# EasyEDA Pro project sensor_board수정본.eprj

# Schematic Schematic1
Board Name: Board1; Create Date: 2025-08-01; Page Name: P1; Project Name: sensor_board수정본; Schematic Name: Schematic1; Update Date: 2025-08-01; Company: EasyEDA.com; Page Size: A4; Version: V1.0
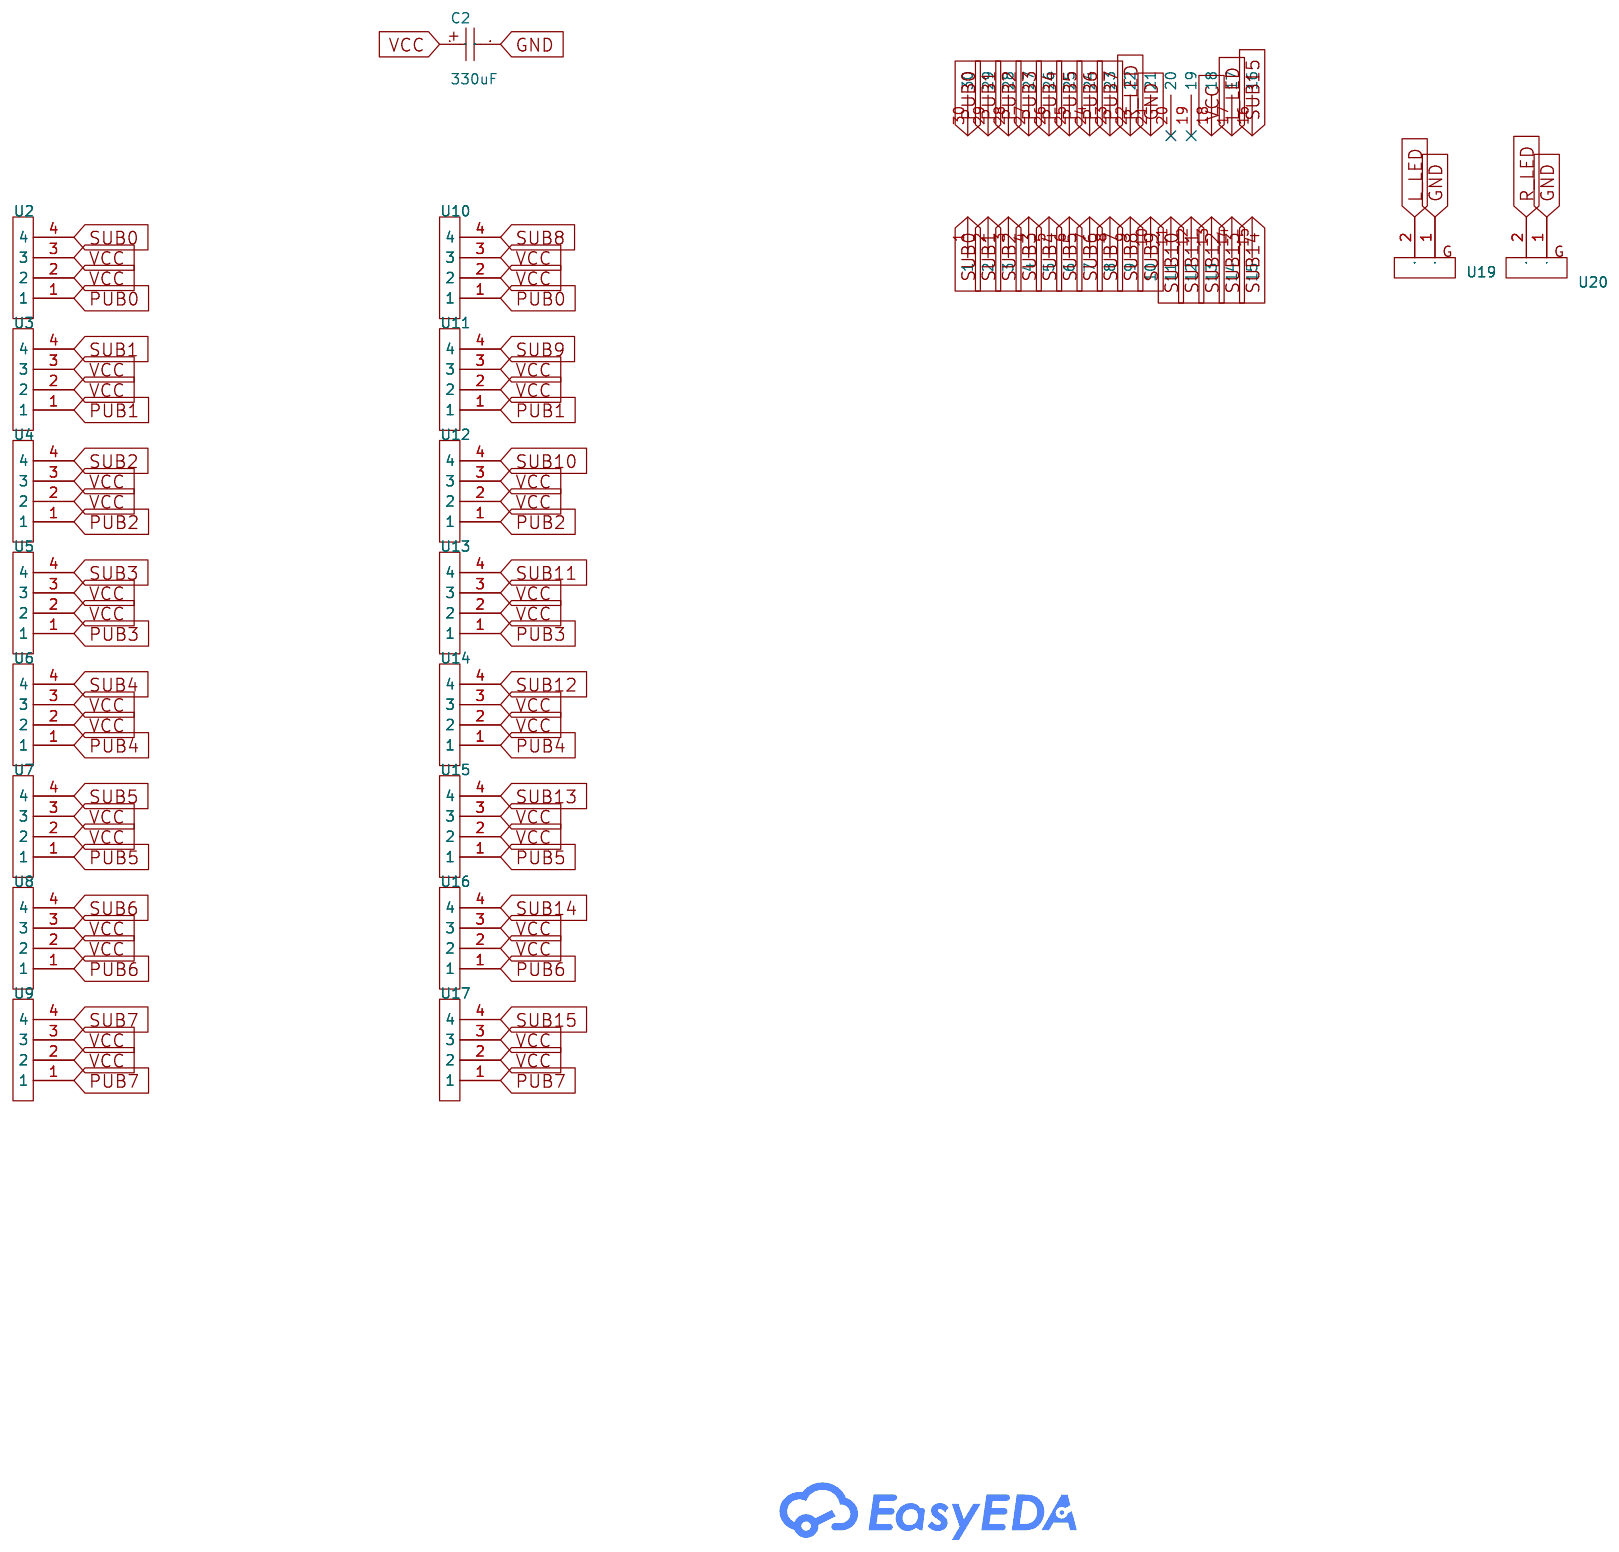
[diagram p0: schematic sheet]

## Parts
C2  330uF  [CASE-D_7343]
U1  -  [header_pin(2*15)]
U2  -  [4pin]
U3  -  [4pin]
U4  -  [4pin]
U5  -  [4pin]
U6  -  [4pin]
U7  -  [4pin]
U8  -  [4pin]
U9  -  [4pin]
U10  -  [4pin]
U11  -  [4pin]
U12  -  [4pin]
U13  -  [4pin]
U14  -  [4pin]
U15  -  [4pin]
U16  -  [4pin]
U17  -  [4pin]
U19  -  [pub_pin]
U20  -  [pub_pin]

## Library data of the parts
C2 = TAJD337M006RNJ: Capacitance: Tolerance:±20% Tolerance:±20% Rated Voltage: Equivalent Series Resistance(ESR):400mΩ@100kHz Operating Temperature:-55℃~+125℃ Operating Temperature:-55℃~+125℃; LCSC Part Name: 330uF ±20% 6.3V; Supplier Part: C22283; Manufacturer: Kyocera AVX; Supplier Footprint: CASE-D-7343; JLCPCB Part Class: Extended Part; Datasheet: https://atta.szlcsc.com/upload/public/pdf/source/20160107/1457707750344.pdf; Supplier: LCSC; Tolerance: ±20%; Equivalent Series Resistance(ESR): 400mΩ@100kHz; Operating Temperature: -55℃~+125℃
U1 = header_pin(2_15)
U2-U17 = 4pin
U19 U20 = pub_pin

## Nets
GND: C2.2 U1.21 U19.1 U20.1
VCC: C2.1 U1.18 U2.2 U2.3 U3.2 U3.3 U4.2 U4.3 U5.2 U5.3 U6.2 U6.3 U7.2 U7.3 U8.2 U8.3 U9.2 U9.3 U10.2 U10.3 U11.2 U11.3 U12.2 U12.3 U13.2 U13.3 U14.2 U14.3 U15.2 U15.3 U16.2 U16.3 U17.2 U17.3
L_LED: U1.17 U19.2
PUB0: U1.30 U2.1 U10.1
PUB1: U1.29 U3.1 U11.1
PUB2: U1.28 U4.1 U12.1
PUB3: U1.27 U5.1 U13.1
PUB4: U1.26 U6.1 U14.1
PUB5: U1.25 U7.1 U15.1
PUB6: U1.24 U8.1 U16.1
PUB7: U1.23 U9.1 U17.1
R_LED: U1.22 U20.2
SUB0: U1.1 U2.4
SUB1: U1.2 U3.4
SUB2: U1.3 U4.4
SUB3: U1.4 U5.4
SUB4: U1.5 U6.4
SUB5: U1.6 U7.4
SUB6: U1.7 U8.4
SUB7: U1.8 U9.4
SUB8: U1.9 U10.4
SUB9: U1.10 U11.4
SUB10: U1.11 U12.4
SUB11: U1.12 U13.4
SUB12: U1.13 U14.4
SUB13: U1.14 U15.4
SUB14: U1.15 U16.4
SUB15: U1.16 U17.4

Not connected (* = marked no-connect by the designer): U1 19* 20*

# Board PCB1
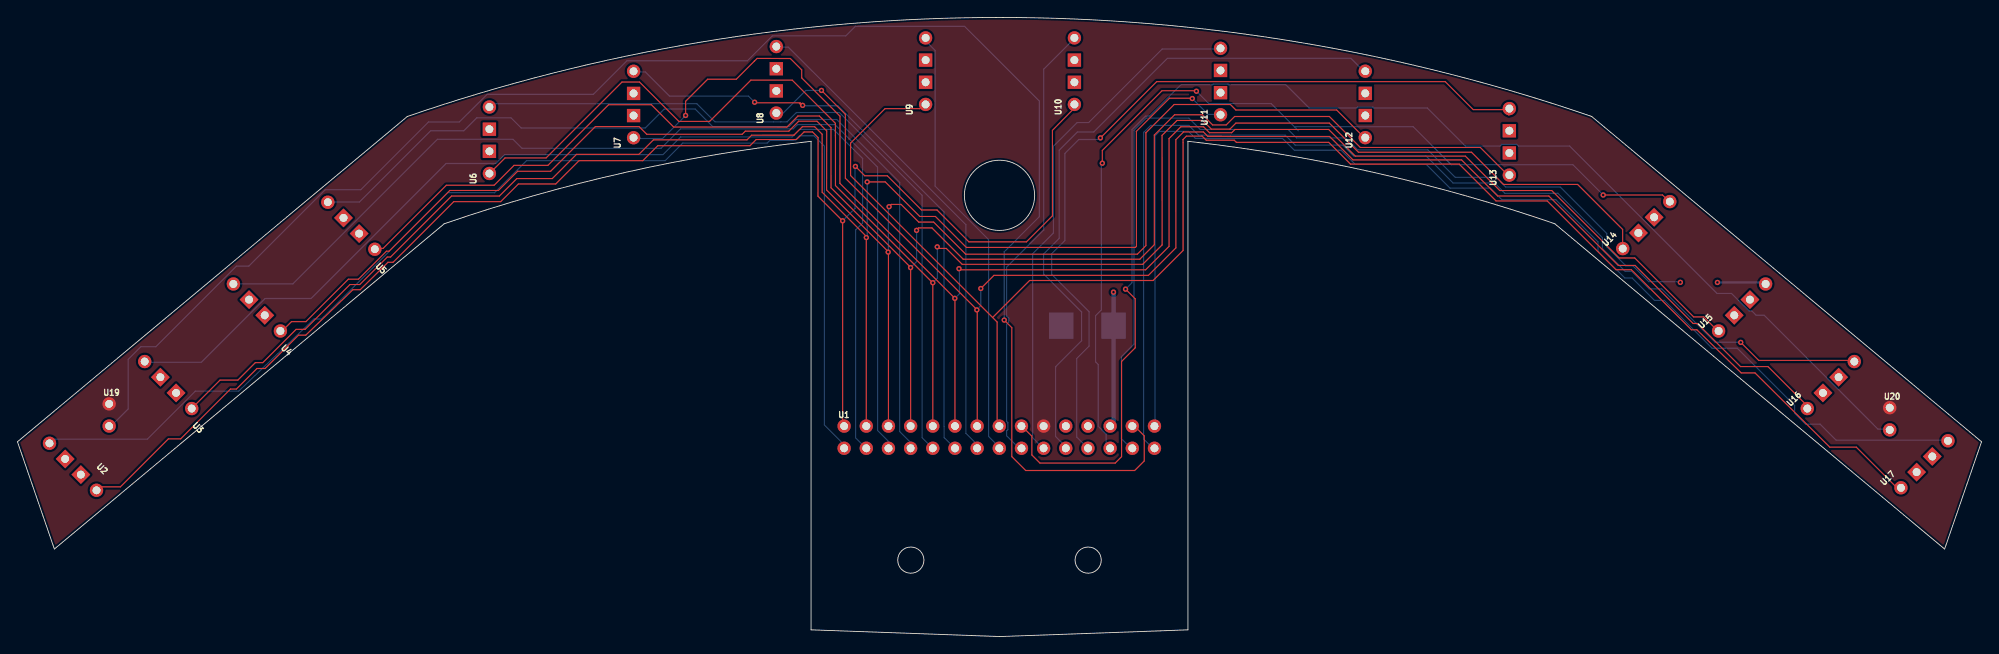
[diagram p1: board, top side]
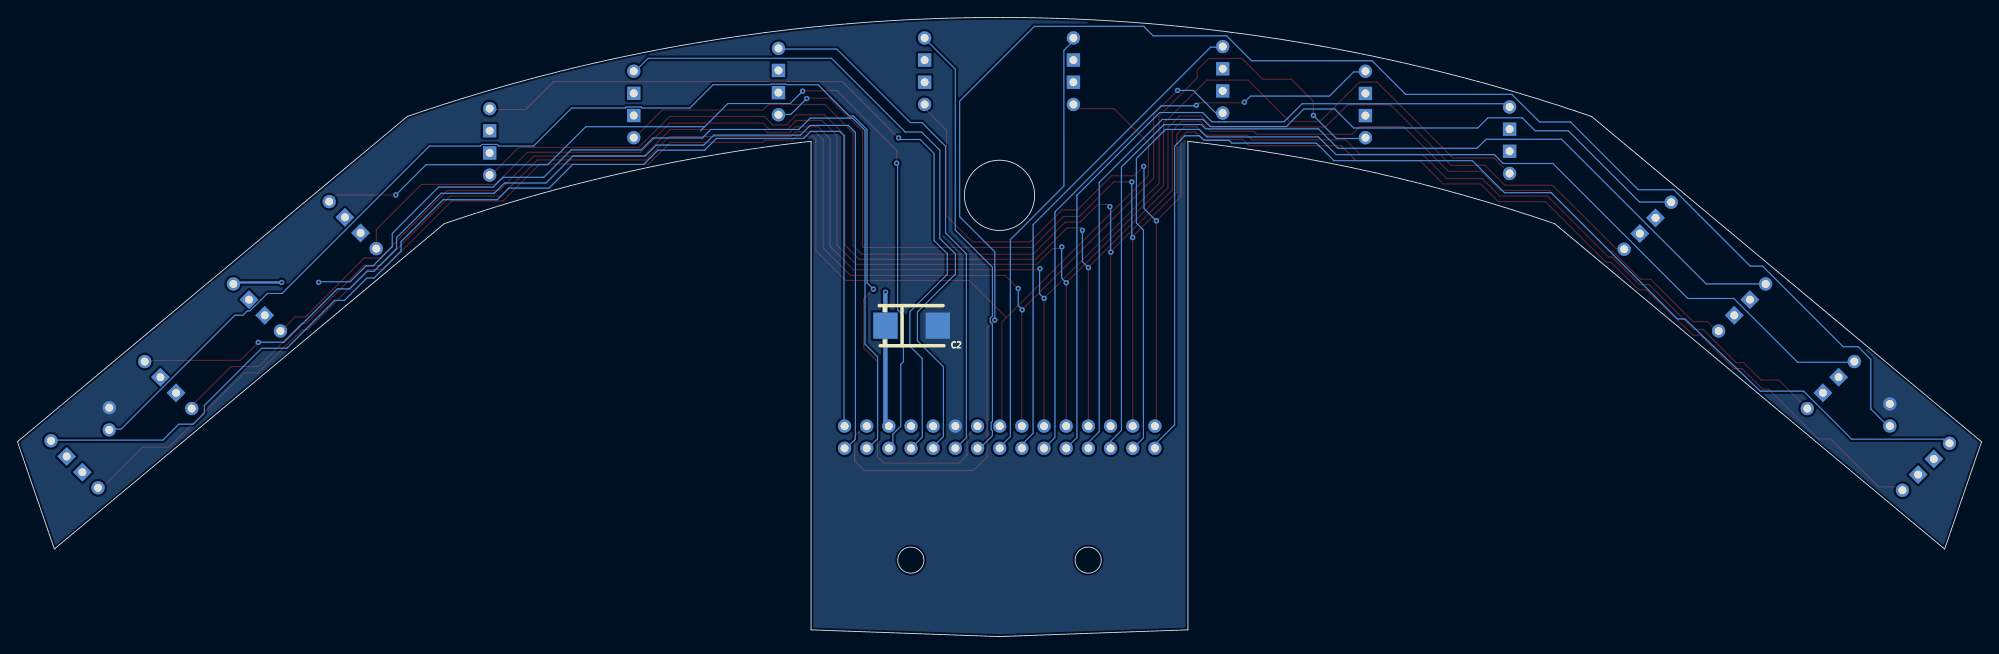
[diagram p2: board, bottom side, seen from below]

Outline 225.05 x 70.96 mm; copper layers: Top Layer, Inner1, Inner2, Bottom Layer. Coordinates in mm from the lower left corner of the outline.
Outline path: circle c102.37,8.76 r1.5 ; circle c112.53,50.57 r4.03 ; circle c122.69,8.76 r1.5 ; 0,22.33 4.23,10.03 48.9,47.31 arc(69.66,53.2) 90.94,56.76 90.94,0.77 112.53,0 134.12,0.77 134.12,56.76 arc(155.39,53.2) 176.15,47.31 220.82,10.03 225.05,22.33 180.38,59.61 arc(112.53,70.96) 44.67,59.61 0,22.33
Stack: Top Layer 0.035mm Outer layer thickness 1oz / Dielectric1 0.2104mm 7628 RC49% 8.6mil / Inner1 0.0152mm Inner layer thickness / Dielectric2 1.065mm 1.1mm H/HOZ Copper / Inner2 0.0152mm Inner layer thickness / Dielectric3 0.2104mm 7628 RC49% 8.6mil / Bottom Layer 0.035mm Outer layer thickness 1oz

## Design rules (mm)
template: Custom Config
spacing copperThickness1oz (default): track to track 0.102, other pairs 0.152 to 0.3
spacing copperThickness2oz: track to track 0.203, other pairs 0.152 to 0.3
track width copperThickness1oz (default): min 0.127, default 0.254, max 2.54
track width copperThickness2oz: min 0.203, default 0.254, max 2.54
differential pair differentialPair (default): width min 0.127, default 0.254, max 2.54; gap min 0.152, default 0.152
via viaSize (default): diameter min 0.5, default 0.61, max 10; hole min 0.3, default 0.305, max 6.3

## Placement (name value [footprint] x y rotation side)
C2  330uF  [CASE-D_7343]  122.6 35.63 0 bottom
U1  -  [header_pin(2*15)]  133.46 24.12 0 top
U2  -  [4pin]  6.37 19.46 135 top
U3  -  [4pin]  17.28 28.83 135 top
U4  -  [4pin]  27.44 37.72 135 top
U5  -  [4pin]  38.26 47.08 135 top
U6  -  [4pin]  54.08 56.88 90 top
U7  -  [4pin]  70.6 60.98 90 top
U8  -  [4pin]  86.95 63.81 90 top
U9  -  [4pin]  104.06 64.8 90 top
U10  -  [4pin]  121.11 64.8 90 top
U11  -  [4pin]  137.85 63.61 90 top
U12  -  [4pin]  154.44 60.99 90 top
U13  -  [4pin]  170.95 56.7 90 top
U14  -  [4pin]  186.64 47.16 45 top
U15  -  [4pin]  197.62 37.72 45 top
U16  -  [4pin]  207.78 28.83 45 top
U17  -  [4pin]  218.51 19.74 45 top
U19  -  [pub_pin]  25.37 11.05 0 top
U20  -  [pub_pin]  229.39 10.61 0 top

## Footprints (pads in the part's own frame, mm; a bottom-side part is the same pattern mirrored in y, then rotated)
4pin
  round 1.524 hole 0.914: 1(-3.81,0) 4(3.81,0)
  rect 1.524x1.524 hole 0.914: 2(-1.27,0) 3(1.27,0)
CASE-D_7343
  rect 2.799x3.01 smd: 1(3,0) 2(-3,0)
header_pin(2*15)
  round 1.524 hole 0.914: 1(-38.735,-2.54) 2(-36.195,-2.54) 3(-33.655,-2.54) 4(-31.115,-2.54) 5(-28.575,-2.54) 6(-26.035,-2.54) 7(-23.495,-2.54) 8(-20.955,-2.54) 9(-18.415,-2.54) 10(-15.875,-2.54) 11(-13.335,-2.54) 12(-10.795,-2.54) 13(-8.255,-2.54) 14(-5.715,-2.54) 15(-3.175,-2.54) 16(-3.175,0) 17(-5.715,0) 18(-8.255,0) 19(-10.795,0) 20(-13.335,0) 21(-15.875,0) 22(-18.415,0) 23(-20.955,0) 24(-23.495,0) 25(-26.035,0) 26(-28.575,0) 27(-31.115,0) 28(-33.655,0) 29(-36.195,0) 30(-38.735,0)
pub_pin
  round 1.524 hole 0.914: 1(-14.859,15.621) 2(-14.859,13.081)

## Nets
As in the schematic.

Pads without a net: U1 19 20

## Via types
v1: diameter 0.61, hole 0.305, Top Layer to Bottom Layer, 29 vias

## Routing (per net, layer and track width the routed paths; a pad name or vN(x,y) marks a point on that pad's centre or on a via; arc(x,y) is an arc through that point)
VCC: length 323
  Inner2 w0.254: 103.58,65.98 103.96,65.98 104.1,65.83 ; 121.06,63.34 121.06,63.36
  Inner2 w0.5: 216.9,18.82 217.62,18.82 218.77,19.97 218.77,20.74 ; 104.1,65.83 104.1,63.93 103.72,63.55 ; 104.06,63.36 121.06,63.36 ; 206.99,27.99 208.74,29.75 199.93,38.56 198.56,38.56 ; 5.24,20.41 5.25,20.41 7.07,18.6 7.81,18.6 17.1,27.89 18.12,27.89 ; 16.39,29.78 16.47,29.78 18.25,28 19.52,28 28.3,36.79 ; 185.73,46.25 187.38,47.9 187.43,47.9 ; 170.85,55.37 170.93,55.45 170.93,57.98 ; 121.08,63.36 122.35,63.36 125.57,60.15 125.57,60.28 129.02,63.73 135.71,63.73 137.11,62.34 137.87,62.34 ; 137.89,64.95 137.87,64.93 137.87,62.34 ; 185.87,46.33 189.05,43.15 193.89,43.15 198.42,38.62 196.63,36.83 196.63,36.5 ; 216.87,18.82 207.87,27.82 206.79,27.82 ; 185.73,46.22 183.34,46.22 174.2,55.37 170.87,55.37 ; 26.52,38.54 26.74,38.54 28.33,36.95 29.9,36.95 39.1,46.26 ; 103.72,63.36 102,63.36 101.55,63.81 88.49,63.81 87.38,64.92 87.08,64.92 ; 39.1,46.26 48.46,55.63 54.12,55.63 ; 39.1,46.26 37.48,47.88 37.37,47.88 ; 88.45,63.81 87.13,62.49 ; 121.14,65.88 121.06,65.81 121.06,63.88 ; 121.55,63.43 121.35,63.63 121.1,63.88 ; 137.87,62.34 137.9,62.34 ; 70.54,59.8 55.82,59.8 54.2,58.18 54.2,55.76 ; 125.56,60.11 125.57,60.12 ; 170.87,57.98 169.14,59.71 154.42,59.71 154.51,59.79 154.51,62.18 154.29,62.39 137.99,62.39 ; 125.59,39.44 125.59,60.1 ; 70.54,62.27 70.54,59.91 ; 86.91,62.57 70.82,62.57
  Bottom Layer w0.254: 137.72,64.45 137.76,64.49 ; 125.61,39.45 v1(125.59,39.47)
  Bottom Layer w0.5: 196.85,36.89 196.85,36.89 ; U1.18 125.6,24.52 125.6,35.63 125.61,39.45
L_LED: length 196.2
  Top Layer w0.127: 127.84,24.27 129.11,23 129.11,20.13 128.01,19.03 115.53,19.03 113.94,20.62 113.94,35.4 v1(113.07,36.27)
  Bottom Layer w0.127: v1(113.07,36.27) 113.07,44.1 117.09,48.12 117.09,61.37 108.52,69.94 96,69.94 94.92,68.85 86.5,68.85 83.64,65.99 69.83,65.99 65.98,62.14 53.82,62.14 50.63,58.98 47.1,58.98 39.34,51.21 35.26,51.21 26.51,42.46 25.09,42.46 15.85,33.22 14.14,33.22 12.69,31.77 12.69,26.09 10.8,24.2 10.62,24.2 10.51,24.31
PUB0: length 182.5
  Top Layer w0.127: 121.71,60.83 121.36,60.83 118.59,58.02 118.59,48.22 115.61,45.24 109.02,45.24 105.37,48.89 103.59,48.89 99.67,52.81 97.09,52.81 v1(96.02,53.88) ; 9.18,16.68 9.66,17.16 11.79,17.16 17.29,22.66 18.7,22.66 24.41,28.36 25.08,28.36 27.44,30.72 28.38,30.72 32.2,34.54 33.03,34.54 38.44,39.75 39.28,39.75 42.46,42.89 43.04,42.89 49.99,49.84 55.37,49.84 57.4,51.87 61.68,51.87 64.35,54.55 71.66,54.54 73.37,56.26 83.94,56.26 84.64,56.96 89.25,56.96 90.13,57.83 91.1,57.83 91.74,57.19 91.73,50.47 v1(94.55,47.65) 94.55,24.29 U1.30
  Bottom Layer w0.127: v1(96.02,53.88) 95.97,53.84 95.97,49.07 v1(94.55,47.65)
PUB1: length 187.4
  Top Layer w0.127: 25.26,29.39 27.26,31.39 28.11,31.39 31.92,35.2 32.96,35.2 38.1,40.34 39.23,40.34 42.38,43.5 42.76,43.5 49.74,50.49 55.21,50.49 57.22,52.49 61.29,52.49 64.06,55.26 71.18,55.26 ; U1.29 97.26,45.87 92.21,50.92 92.2,57.57 91.34,58.43 89.94,58.43 88.97,57.46 84.13,57.46 83.6,56.93 72.87,56.93 71.19,55.25 ; 128.19,57.89 132.01,61.7 134.58,61.7 v1(134.62,61.66) ; v1(97.37,52.11) 99.43,52.11 103.39,48.15 105.18,48.15 108.73,44.6 128.09,44.6 128.22,44.72 128.22,57.89 ; 25.26,29.39 23.21,29.39 19.99,26.17 ; 19.98,26.13 U3.1
  Bottom Layer w0.127: v1(97.37,52.11) 97.37,45.84 97.26,45.73 ; 137.97,59.3 137.43,59.84 136.44,59.84 v1(134.62,61.66)
  vias: v1(97.27,45.73)
PUB2: length 189.5
  Top Layer w0.127: 129.3,57.74 129.3,57.74 ; 129.3,57.74 129.3,44.8 128.32,43.82 108.66,43.82 104.98,47.5 103.27,47.5 101.25,49.53 100.13,49.53 99.96,49.36 99.96,49.28 ; 129.3,57.74 132.54,60.98 138.98,60.98 139.61,60.35 151.16,60.35 154.53,56.98 154.53,56.84 ; U1.28 99.8,44.09 92.71,51.18 92.73,57.95 91.61,59.07 89.52,59.07 88.38,57.92 83.4,57.92 83.04,57.57 72.11,57.57 71.23,58.45 66.22,58.45 61.1,53.33 57.3,53.33 55.1,51.12 49.54,51.12 42.58,44.17 42.28,44.17 39.07,40.96 37.91,40.96 33.05,36.09 31.4,36.09 30.26,34.95 ; 154.47,56.78 154.45,56.77 ; 30.12,34.98 30.23,35.09
  Bottom Layer w0.127: 99.87,49.3 99.79,49.23 99.79,44.01
  vias: v1(99.77,44.06) v1(99.87,49.27)
PUB3: length 191.6
  Top Layer w0.127: 170.93,52.19 170.93,52.74 167.61,56.05 153.87,56.05 150.32,59.6 139.47,59.6 138.5,58.64 136.95,58.64 135.78,59.8 132.59,59.8 130.27,57.48 130.27,44.91 128.6,43.24 108.37,43.24 104.78,46.84 103.24,46.84 103.02,46.62 ; 41.14,44.48 41.9,44.48 49.14,51.72 54.62,51.72 56.89,54 60.78,54 67.73,60.95 72.63,60.95 75.19,58.39 88.17,58.39 89.43,59.66 91.89,59.66 93.22,58.33 93.22,51.43 102.34,42.31 U1.27
  Bottom Layer w0.127: v1(103.02,46.55) 103.02,42.97 v1(102.34,42.29)
PUB4: length 195.3
  Top Layer w0.127: 53.86,52.91 53.93,52.91 55.87,54.85 60.57,54.85 69.27,63.55 71.28,63.55 75.79,59.04 79.31,59.04 84.04,63.77 88.77,63.77 93.72,58.82 93.72,57.39 93.73,57.21 93.73,51.69 104.88,40.53 U1.26 ; 105.38,44.64 105.42,44.64 105.58,44.48 106.43,44.48 108.25,42.66 128.94,42.66 131.16,44.89 131.15,57.44 132.86,59.15 135.8,59.15 136.8,58.15 138.92,58.15 139.61,58.85 150.32,58.85 153.66,55.51 166.61,55.51 170.28,51.82 178.77,51.82 183.93,46.66 183.93,44.5
  Bottom Layer w0.127: v1(104.88,40.55) 105.4,41.07 105.4,44.65 v1(105.39,44.66)
PUB5: length 187.6
  Top Layer w0.127: U1.25 107.42,38.76 94.24,51.94 94.25,59.64 89.86,64.03 89.86,64.95 88.56,66.25 84.75,66.26 84.45,65.96 ; 84.45,65.96 84.45,65.96 ; 84.45,65.96 84.44,65.96 82.36,63.87 79.09,63.87 76.56,61.35 v1(76.56,59.72) ; v1(107.88,42.16) 108.01,42.03 129.27,42.03 131.95,44.72 131.95,57.07 133.31,58.42 135.91,58.42 136.59,57.74 139.12,57.74 139.5,58.12 150.24,58.12 153.3,55.06 165.91,55.06 169.85,51.12 175.8,51.12 183.53,43.39 185.31,43.39 192.07,36.64 193.22,36.64 194.87,34.98 194.97,34.98
  Bottom Layer w0.127: v1(107.41,38.76) 107.93,39.28 107.93,42.11 v1(107.88,42.16) ; 70.62,56.77 70.93,57.08 73.92,57.08 76.56,59.72 v1(76.56,59.72)
PUB6: length 180.3
  Top Layer w0.127: 205.04,26.08 205.04,26.48 200.58,30.94 197.44,30.94 192.5,35.88 192.01,35.88 185.35,42.53 183.43,42.53 175.47,50.49 169.61,50.49 165.47,54.63 153.03,54.63 150.35,57.31 139.03,57.31 ; 136.42,57.32 139.02,57.32 139.03,57.31 ; 136.42,57.32 136.4,57.32 135.88,57.83 133.62,57.83 132.73,56.95 132.73,44.54 129.59,41.39 111.89,41.39 v1(110.38,39.89) ; 136.42,57.32 139.03,57.31 ; 109.98,23.97 109.98,37.42 94.86,52.53 94.86,59.85 v1(92.13,62.59)
  Bottom Layer w0.127: v1(92.13,62.59) 90.33,62.59 87.13,59.4 87.09,59.4
  Bottom Layer w0.128: 109.96,37.5 110.38,37.92 v1(110.38,39.89)
  vias: v1(109.93,37.44)
PUB7: length 185.8
  Top Layer w0.127: 103.4,60.49 103.39,60.5 99.41,60.5 95.46,56.56 95.46,52.83 ; 215.8,16.93 215.47,16.93 210.7,21.71 207.66,21.71 199.09,30.22 197.51,30.22 192.43,35.16 191.81,35.16 184.92,42.04 183.17,42.04 175.28,49.93 169.42,49.93 165.2,54.15 152.74,54.15 150.25,56.64 139.67,56.64 139.43,56.88 136.22,56.88 135.75,57.35 133.94,57.35 133.55,56.96 133.56,56.6 133.56,44.25 130.12,40.81 115.97,40.81 111.74,36.57 ; 112.42,24.18 112.26,24.34 112.26,36.05 111.74,36.57 ; 111.74,36.57 95.47,52.83
R_LED: length 159.4
  Top Layer w0.127: v1(126.97,39.82) 128.08,38.71 128.08,33.1 126.51,31.53 126.51,20.62 125.78,19.88 117.16,19.88 116.24,20.81 116.24,22.97 115.06,24.14
  Bottom Layer w0.127: v1(126.97,39.82) 127.71,40.55 127.71,58.1 129.25,59.65 129.72,59.65 133.31,63.24 136.93,63.24 137,63.32 138.7,63.32 138.78,63.24 145.34,63.24 148.01,60.58 153.47,60.58 153.58,60.69 155.29,60.69 155.41,60.58 161.55,60.58 165.91,56.21 169.9,56.21 170.09,56.41 171.8,56.41 171.99,56.21 177.85,56.21 194.74,39.32 196.41,39.32 197.88,37.85 197.89,37.85 198.43,37.32 198.73,37.32 199.22,36.83 200.14,36.83 213.18,23.77 214.03,23.77 214.46,24.2
SUB0: length 139.3
  Bottom Layer w0.127: 14.91,22.62 4.33,22.62 3.7,21.99 ; 14.91,22.65 20.38,28.12 25.34,28.12 33.98,36.4 34.84,36.4 49.32,50.88 54.66,50.87 58.34,54.54 74.21,54.54 76.23,56.56 85.9,56.56 86.22,56.87 88.75,56.87 arc(88.94,56.89) 89.13,56.92 89.62,57.41 ; U1.1 94.72,21.99 92.46,24.25 92.46,56.2 ; 89.63,57.4 91.28,57.4 92.43,56.23
SUB1: length 128.8
  Bottom Layer w0.127: 21.1,31.44 14.54,31.44 ; 97.23,21.57 96.04,22.76 96.04,46.59 96.84,47.4 96.84,54.79 93.68,57.95 93.53,58.11 93.53,58.12 89.62,58.12 88.76,57.26 75.99,57.26 ; 75.99,57.26 75.97,57.26 ; 75.99,57.26 73.97,55.23 55.82,55.23 54.8,54.22 49.11,54.22 33.64,38.74 28.38,38.74 21.1,31.46 ; 75.99,57.26 76,57.27
SUB2: length 117
  Bottom Layer w0.127: U1.3 99.8,22.37 98.56,23.62 98.56,53.8 93.68,58.67 89.39,58.68 88.9,58.19 75.98,58.19 73.75,55.96 57.82,55.96 56.78,56.99 48.12,56.99 31.55,40.42 24.74,40.42
SUB3: length 105.9
  Bottom Layer w0.127: 52.64,59.45 51.15,57.97 47.41,57.97 ; 52.64,59.45 52.65,59.47 ; 52.64,59.45 56.55,59.45 57.71,58.29 71.94,58.29 74.11,60.46 77.65,60.46 79.66,58.45 88.41,58.45 ; U1.4 102.34,22.25 101.1,23.49 101.1,52.04 93.88,59.26 89.21,59.26 88.41,58.46 ; 35.7,49.8 39.18,49.8 47.38,58
SUB4: length 84.5
  Bottom Layer w0.127: 94.17,60.06 89.26,60.06 88.2,59 87.46,59 87.45,58.98 86.64,58.98 86.63,59 79.92,59 77.85,61.07 54.28,61.07 54.03,60.82 ; 94.17,60.06 103.66,50.57 103.66,22.79 104.88,21.58
SUB5: length 70.2
  Top Layer w0.127: 89.59,61.11 89.82,60.88 v1(89.97,60.88) 89.68,61.17 84.53,61.17 v1(84.47,61.24)
  Bottom Layer w0.127: 70.61,64.71 71.94,64.71 74.71,61.94 83.76,61.94 v1(84.47,61.24) ; v1(89.97,60.88) 90.01,60.83 94,60.83 106.17,48.66 106.17,24.08 ; 106.18,24.08 106.18,22.8 107.36,21.62
SUB6: length 56.2
  Bottom Layer w0.127: 109.82,21.5 109.82,22.15 108.68,23.29 108.68,47.2 88.33,67.55 87.11,67.55
SUB7: length 50.7
  Bottom Layer w0.127: 103.52,68.1 104.23,68.1 105.15,67.18 105.15,51.62 111.27,45.5 111.27,42.93 ; 111.28,42.91 111.27,42.93 ; 111.28,42.91 111.28,22.93 112.59,21.62 ; 111.28,42.91 111.28,42.92 111.27,42.93
SUB8: length 51.8
  Bottom Layer w0.127: 115.02,21.68 114.68,21.68 113.34,23.02 113.34,23.57 113.48,23.72 113.48,24.52 113.34,24.67 113.34,35.8 113.59,36.05 113.59,36.48 113.34,36.73 113.34,42.34 117.6,46.6 117.59,65.03 120.81,68.25 121.59,68.25 121.67,68.17
SUB9: length 59.9
  Bottom Layer w0.127: 117.59,21.53 116.33,22.79 116.33,43.87 118.7,46.25 118.7,56.2 121.42,58.91 122.74,58.91 131.17,67.33 137.86,67.33
SUB10: length 78.6
  Bottom Layer w0.127: 118.96,30.93 121.93,33.9 121.93,37.2 117.58,41.55 117.58,43.85 119.37,45.64 119.37,55.74 121.45,57.83 123.32,57.83 131.77,66.27 152.8,66.27 154.44,64.62 ; 118.96,30.93 118.96,22.92 120.09,21.79 120.09,21.55
SUB11: length 93.1
  Top Layer w0.127: v1(124.09,57.15) 130.54,63.6 163.6,63.6 166.8,60.39 170.26,60.39 170.89,59.76
  Bottom Layer w0.127: v1(124.09,57.15) 123.91,56.97 121.62,56.97 120.02,55.37 120.02,45.38 118.51,43.88 118.51,41.51 122.79,37.23 122.79,33.28 121.38,31.87 121.38,22.86 122.64,21.6
SUB12: length 108.9
  Top Layer w0.127: v1(181.7,50.61) 188.5,50.61 189.29,49.82 ; v1(124.31,54.25) 124.31,55.72 131.15,62.56 135.03,62.56 v1(135.09,62.5)
  Bottom Layer w0.127: 146.77,57.96 143.64,61.09 136.5,61.09 v1(135.09,62.5) ; v1(181.7,50.61) 178.23,54.08 164.28,54.08 159.93,58.43 146.33,58.43 ; 125.17,21.56 125.07,21.56 124.74,21.89 124.74,23.2 123.84,24.1 123.84,31.19 123.54,31.48 123.54,36.78 124.2,37.44 124.2,54.11 124.31,54.22 v1(124.31,54.25)
SUB13: length 119.3
  Inner2 w0.127: v1(190.54,40.6) 190.56,40.58 v1(194.79,40.58)
  Bottom Layer w0.127: 127.71,21.46 126.49,22.68 126.49,32.07 127.93,33.51 127.93,58.01 129.35,59.42 134.22,59.42 135.52,58.12 145.6,58.12 146.57,57.15 152.2,57.15 153.56,55.78 161.6,55.78 164.74,52.64 169.41,52.63 170.52,51.52 176.78,51.52 182.1,46.2 182.1,44.68 184.3,42.49 185.1,42.49 186.92,40.67 190.47,40.67 190.53,40.61
  Bottom Layer w0.254: v1(194.79,40.58) 200.11,40.58 200.3,40.39
SUB14: length 130.7
  Top Layer w0.127: v1(197.46,33.71) 199.52,31.65 210.5,31.65 210.61,31.76
  Bottom Layer w0.127: 181.61,44.46 181.61,45.71 176.51,50.8 170.43,50.8 169.25,51.98 164.49,51.98 161.38,55.09 153.1,55.09 151.87,56.33 146.4,56.33 145.26,57.47 135.33,57.47 134.22,58.58 129.84,58.58 129.04,57.78 129.04,22.64 130.24,21.44 ; 181.61,44.46 184.22,41.86 184.97,41.86 186.98,39.85 188.4,39.85 194.52,33.73 197.44,33.73 ; 181.61,44.46 181.61,44.47 ; 197.44,33.69 197.47,33.69
SUB15: length 140.1
  Bottom Layer w0.127: 130.34,24.18 130.34,57.39 130.85,57.9 134.17,57.9 134.97,57.09 144.96,57.09 146.31,55.74 151.67,55.74 153.3,54.1 161.44,54.1 164.15,51.39 168.76,51.39 170.08,50.07 176.27,50.07 181.1,45.24 181.1,44.18 184.19,41.09 185.01,41.09 187.59,38.52 188.7,38.52 194.18,33.05 197.06,33.05 203.63,26.48 203.63,25.61 204.9,24.34 206.56,24.34 208.39,22.51 220.51,22.51 220.7,22.7 221.17,22.7

## Copper pours and planes (outline as drawn; the poured copper is in the pictures)
GND on Top Layer: -4.16,75.52 228.6,75.52 228.6,-3.24 -4.16,-3.24
GND on Bottom Layer: -3.83,75.39 228.63,75.39 228.63,-3.31 -3.83,-3.31
GND on Inner1: -3.82,75.39 228.65,75.39 228.65,-3.31 -3.82,-3.31
GND on Inner2: -3.9,75.57 228.66,75.57 228.66,-3.3 -3.9,-3.3
